# EAGLE design Schlangomat (EAGLE 7.2.0)

## Sheet 1 of 4
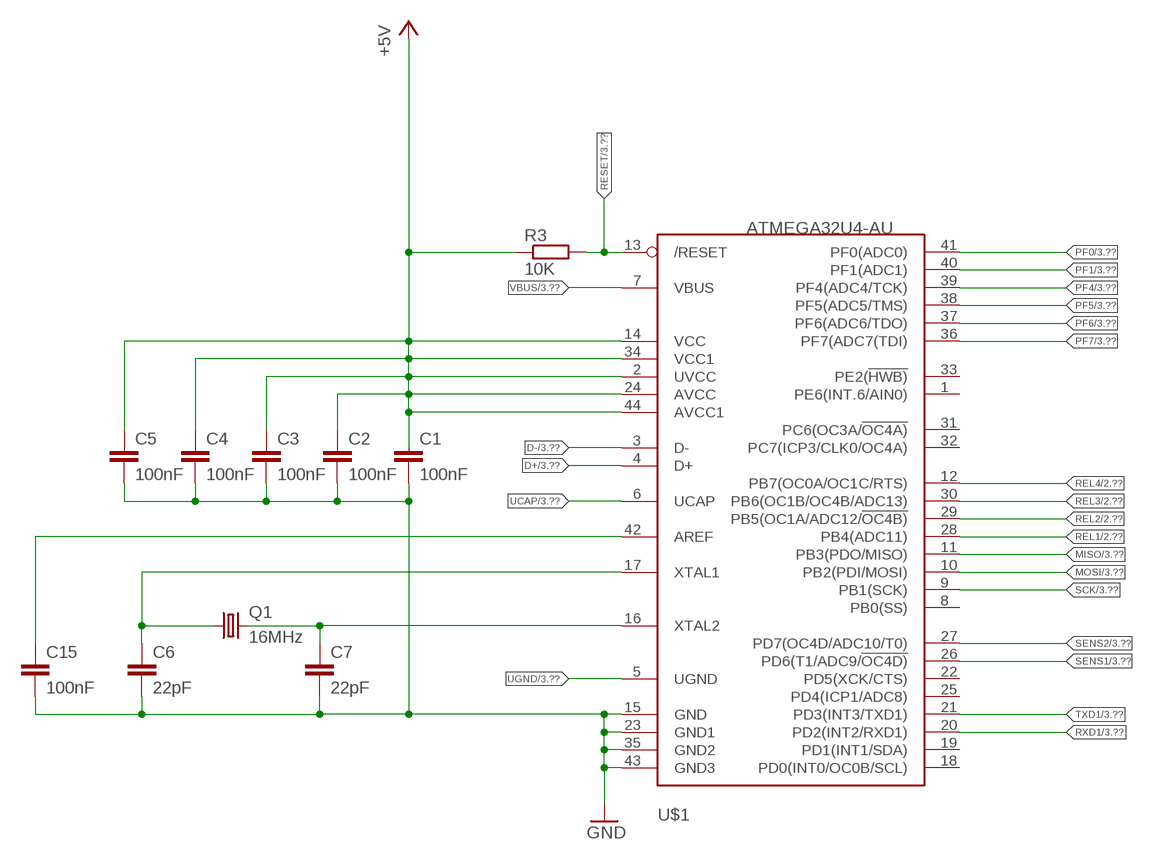
[diagram p0: schematic, sheet 1]

### Parts
C1  100nF  C-EUC0805  [C0805]
C2  100nF  C-EUC0805  [C0805]
C3  100nF  C-EUC0805  [C0805]
C4  100nF  C-EUC0805  [C0805]
C5  100nF  C-EUC0805  [C0805]
C6  22pF  C-EUC0805  [C0805]
C7  22pF  C-EUC0805  [C0805]
C15  100nF  C-EUC0805  [C0805]
Q1  16MHz  CRYSTALHC49S  [HC49/S]
R3  10K  R-EU_R0805  [R0805]
U$1  ATMEGA32U4-AU  [TQFP44]

### Nets
+5V [DC]: C1.1 C2.1 C3.1 C4.1 C5.1 R3.1 U$1.2(UVCC) U$1.14(VCC) U$1.24(AVCC) U$1.34(VCC1) U$1.44(AVCC1) ; also sheet 2,3,4
D+: U$1.4(D+) ; also sheet 3
D-: U$1.3(D-) ; also sheet 3
GND [DC]: C1.2 C2.2 C3.2 C4.2 C5.2 C6.2 C7.2 C15.2 U$1.15(GND) U$1.23(GND1) U$1.35(GND2) U$1.43(GND3) ; also sheet 2,3,4
MISO: U$1.11(PB3(PDO/MISO)) ; also sheet 3
MOSI: U$1.10(PB2(PDI/MOSI)) ; also sheet 3
N$3: C6.1 Q1.1 U$1.17(XTAL1)
N$4: C7.1 Q1.2 U$1.16(XTAL2)
N$11: C15.1 U$1.42(AREF)
PF0: U$1.41(PF0(ADC0)) ; also sheet 3
PF1: U$1.40(PF1(ADC1)) ; also sheet 3
PF4: U$1.39(PF4(ADC4/TCK)) ; also sheet 3
PF5: U$1.38(PF5(ADC5/TMS)) ; also sheet 3
PF6: U$1.37(PF6(ADC6/TDO)) ; also sheet 3
PF7: U$1.36(PF7(ADC7(TDI)) ; also sheet 3
REL1: U$1.28(PB4(ADC11)) ; also sheet 2
REL2: U$1.29(PB5(OC1A/ADC12/!OC4B)) ; also sheet 2
REL3: U$1.30(PB6(OC1B/OC4B/ADC13)) ; also sheet 2
REL4: U$1.12(PB7(OC0A/OC1C/RTS)) ; also sheet 2
RESET: R3.2 U$1.13(/RESET) ; also sheet 3
RXD1: U$1.20(PD2(INT2/RXD1)) ; also sheet 3
SCK: U$1.9(PB1(SCK)) ; also sheet 3
SENS1: U$1.26(PD6(T1/ADC9/!OC4D)) ; also sheet 3
SENS2: U$1.27(PD7(OC4D/ADC10/T0)) ; also sheet 3
TXD1: U$1.21(PD3(INT3/TXD1)) ; also sheet 3
UCAP: U$1.6(UCAP) ; also sheet 3
UGND: U$1.5(UGND) ; also sheet 3
VBUS: U$1.7(VBUS) ; also sheet 3
Unconnected: U$1.1(PE6(INT.6/AIN0)) U$1.8(PB0(SS)) U$1.18(PD0(INT0/OC0B/SCL)) U$1.19(PD1(INT1/SDA)) U$1.22(PD5(XCK/CTS)) U$1.25(PD4(ICP1/ADC8)) U$1.31(PC6(OC3A/!OC4A)) U$1.32(PC7(ICP3/CLK0/OC4A)) U$1.33(PE2(!HWB))

## Sheet 2 of 4: Relais
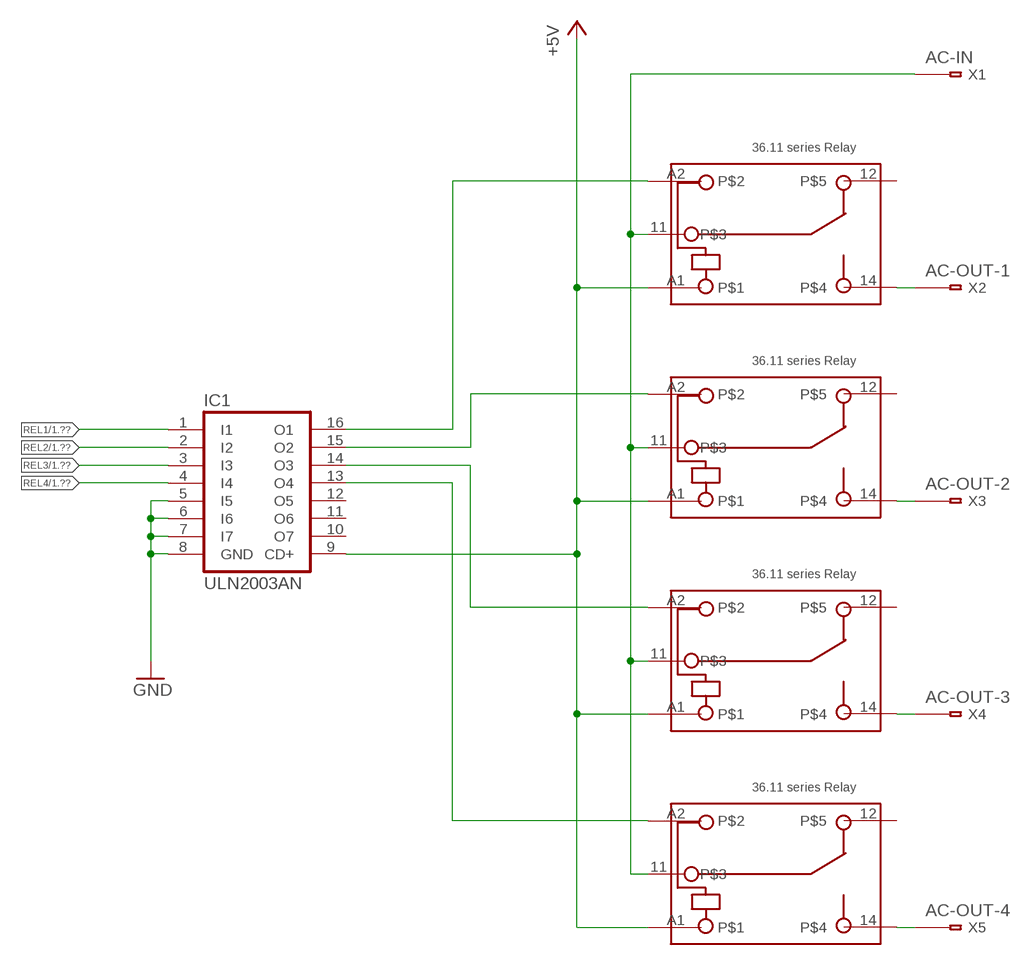
[diagram p1: schematic, sheet 2]

### Parts
IC1  ULN2003AN  [DIL16]
K1  36.11  [36.11]
K2  36.11  [36.11]
K3  36.11  [36.11]
K4  36.11  [36.11]
X1  AC-IN  236-501-7,62  [236-5XX]
X2  AC-OUT-1  236-501-7,62  [236-5XX]
X3  AC-OUT-2  236-501-7,62  [236-5XX]
X4  AC-OUT-3  236-501-7,62  [236-5XX]
X5  AC-OUT-4  236-501-7,62  [236-5XX]

### Nets
+5V [DC]: IC1.9(CD+) K1.A1 K2.A1 K3.A1 K4.A1 ; also sheet 1,3,4
AC_IN [AC]: K1.11 K2.11 K3.11 K4.11 X1.1@2(B1)
GND [DC]: IC1.5(I5) IC1.6(I6) IC1.7(I7) IC1.8(GND) ; also sheet 1,3,4
N$6: IC1.16(O1) K1.A2
N$7: IC1.15(O2) K2.A2
N$8: IC1.14(O3) K3.A2
N$9: IC1.13(O4) K4.A2
N$10: K1.14 X2.1@2(B1)
N$12: K2.14 X3.1@2(B1)
N$13: K3.14 X4.1@2(B1)
N$14: K4.14 X5.1@2(B1)
REL1: IC1.1(I1) ; also sheet 1
REL2: IC1.2(I2) ; also sheet 1
REL3: IC1.3(I3) ; also sheet 1
REL4: IC1.4(I4) ; also sheet 1
Unconnected: IC1.10(O7) IC1.11(O6) IC1.12(O5) K1.12 K2.12 K3.12 K4.12 X1.1@1(A1) X2.1@1(A1) X3.1@1(A1) X4.1@1(A1) X5.1@1(A1)

## Sheet 3 of 4: External
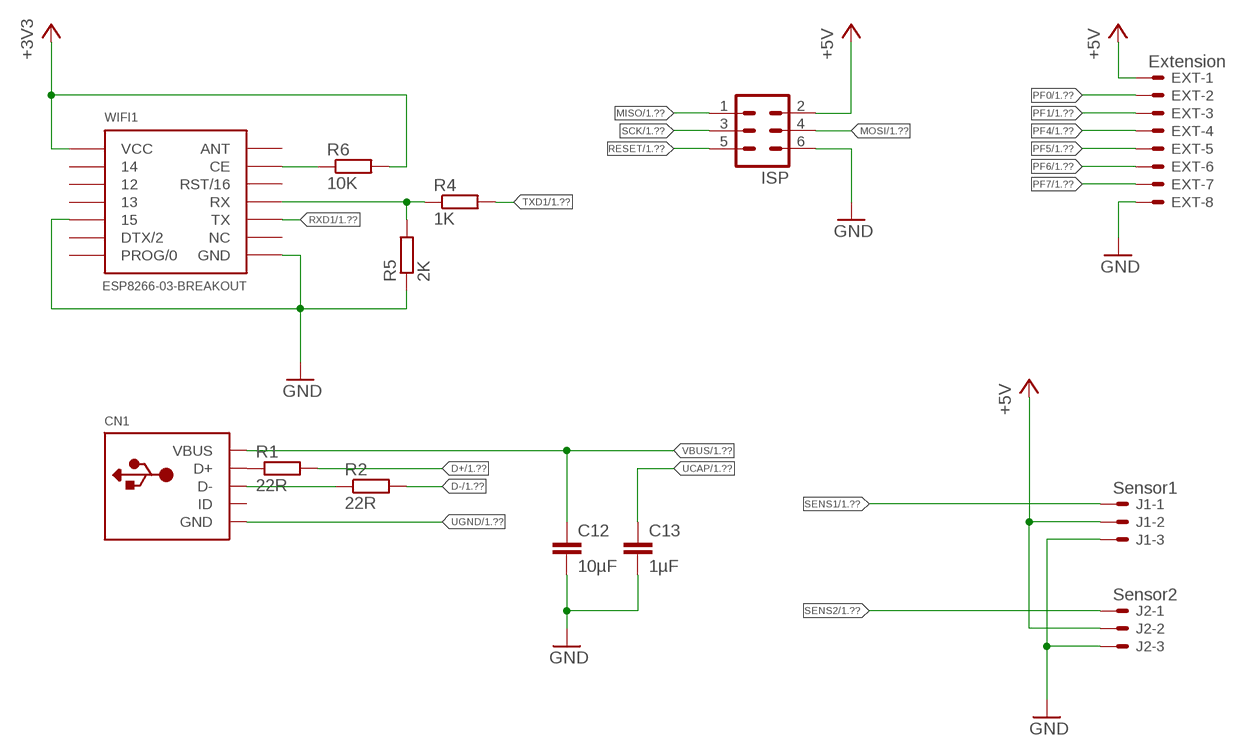
[diagram p2: schematic, sheet 3]

### Parts
C12  10µF  C-EUC0805  [C0805]
C13  1µF  C-EUC0805  [C0805]
CN1  USBMOLEX  [USB-MINIB-THM-MOLEX]
EXT  Extension  22-27-2081-08  [6410-08]
ISP  ML6  [ML6]
J1  Sensor1  22-27-2031-03  [6410-03]
J2  Sensor2  22-27-2031-03  [6410-03]
R1  22R  R-EU_R0805  [R0805]
R2  22R  R-EU_R0805  [R0805]
R4  1K  R-EU_R0805  [R0805]
R5  2K  R-EU_R0805  [R0805]
R6  10K  R-EU_R0805  [R0805]
WIFI1  ESP8266-03-BREAKOUT  [ESP-03-BREAKOUT]

### Nets
+3V3: R6.2 WIFI1.VCC ; also sheet 4
+5V [DC]: EXT.1 ISP.2 J1.2 J2.2 ; also sheet 1,2,4
D+: R1.2 ; also sheet 1
D-: R2.2 ; also sheet 1
GND [DC]: C12.2 C13.2 EXT.8 ISP.6 J1.3 J2.3 R5.1 WIFI1.15 WIFI1.GND ; also sheet 1,2,4
MISO: ISP.1 ; also sheet 1
MOSI: ISP.4 ; also sheet 1
N$1: CN1.D+ R1.1
N$2: CN1.D- R2.1
N$5: R6.1 WIFI1.CE
PF0: EXT.2 ; also sheet 1
PF1: EXT.3 ; also sheet 1
PF4: EXT.4 ; also sheet 1
PF5: EXT.5 ; also sheet 1
PF6: EXT.6 ; also sheet 1
PF7: EXT.7 ; also sheet 1
RESET: ISP.5 ; also sheet 1
RXD1: WIFI1.TX ; also sheet 1
SCK: ISP.3 ; also sheet 1
SENS1: J1.1 ; also sheet 1
SENS2: J2.1 ; also sheet 1
TXD1: R4.1 R4.2 R5.2 WIFI1.RX ; also sheet 1
UCAP: C13.1 ; also sheet 1
UGND: CN1.GND ; also sheet 1
VBUS: C12.1 CN1.VBUS ; also sheet 1
Unconnected: CN1.ID WIFI1.12 WIFI1.13 WIFI1.14 WIFI1.ANT WIFI1.DTX/2 WIFI1.NC WIFI1.PROG/0 WIFI1.RST/16

## Sheet 4 of 4: Power
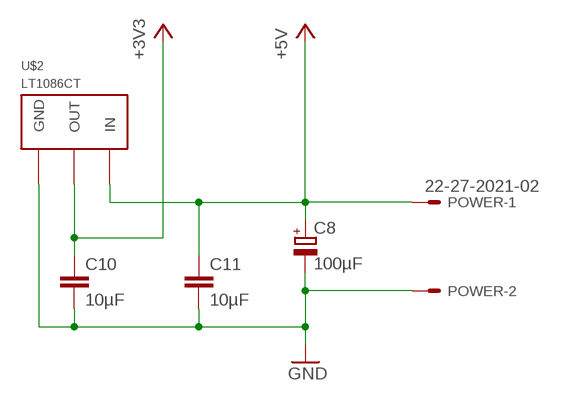
[diagram p3: schematic, sheet 4]

### Parts
C8  100µF  CPOL-EUUD-5X5,8  [UD-5X5,8_NICHICON]
C10  10µF  C-EUC0805  [C0805]
C11  10µF  C-EUC0805  [C0805]
POWER  22-27-2021-02  [6410-02]
U$2  LT1086CT  [TO220V]

### Nets
+3V3: C10.1 U$2.2(OUT) ; also sheet 3
+5V [DC]: C8.+ C11.1 POWER.1 U$2.3(IN) ; also sheet 1,2,3
GND [DC]: C8.- C10.2 C11.2 POWER.2 U$2.1(GND) ; also sheet 1,2,3

## Library data of the parts
C1-C7 C10-C13 C15 = rcl:C-EU: CAPACITOR, European symbol
C8 = rcl:CPOL-EU: POLARIZED CAPACITOR, European symbol
CN1 = adafruit:USB: USB Connectors USBMINIB - Surface Mount Female Mini-B USB Connector 4UConnector: 06564 By microbuilder.eu Thru-hole RA Female Mini-B USB Connector 4UConnector: 18732 By ladyada.net
EXT = con-molex:22-?-08: CONNECTOR wire to board 2.54 mm (.1 inch) pitch header; OC_FARNELL: unknown; OC_NEWARK: unknown
IC1 = uln-udn:ULN2003A: DRIVER ARRAY
ISP = con-harting-ml:ML6: HARTING; OC_FARNELL: unknown; OC_NEWARK: unknown
J1 J2 = con-molex:22-?-03: CONNECTOR wire to board 2.54 mm (.1 inch) pitch header; OC_FARNELL: unknown; OC_NEWARK: unknown
K1-K4 = relay_finder_36_11:36.11: Printed circuit mount miniature 10 A relay one pole changeover contacts Conform RoHS
POWER = con-molex:22-?-02: CONNECTOR wire to board 2.54 mm (.1 inch) pitch header; OC_FARNELL: unknown; OC_NEWARK: unknown
Q1 = crystal:CRYSTAL: CRYSTAL; OC_FARNELL: 1667008; OC_NEWARK: unknown
R1-R6 = rcl:R-EU_: RESISTOR, European symbol
U$1 = adafruit:ATMEGA32U4: http://www.ladyada.net/library/eagle
U$2 = Zap-Powerconverters:LT1086CT
WIFI1 = ZAP-Wireless:ESP8266-03-BREAKOUT
X1-X5 = con-wago:236: Anreihbare Einzelklemme 2,5 mm² 16A Rastermaß 5/5,08 | 7,5/7,62 | 10/10,16

## Net classes
1 AC: width 2 mm, clearance 2 mm
2 DC: width 0.508 mm

## Board
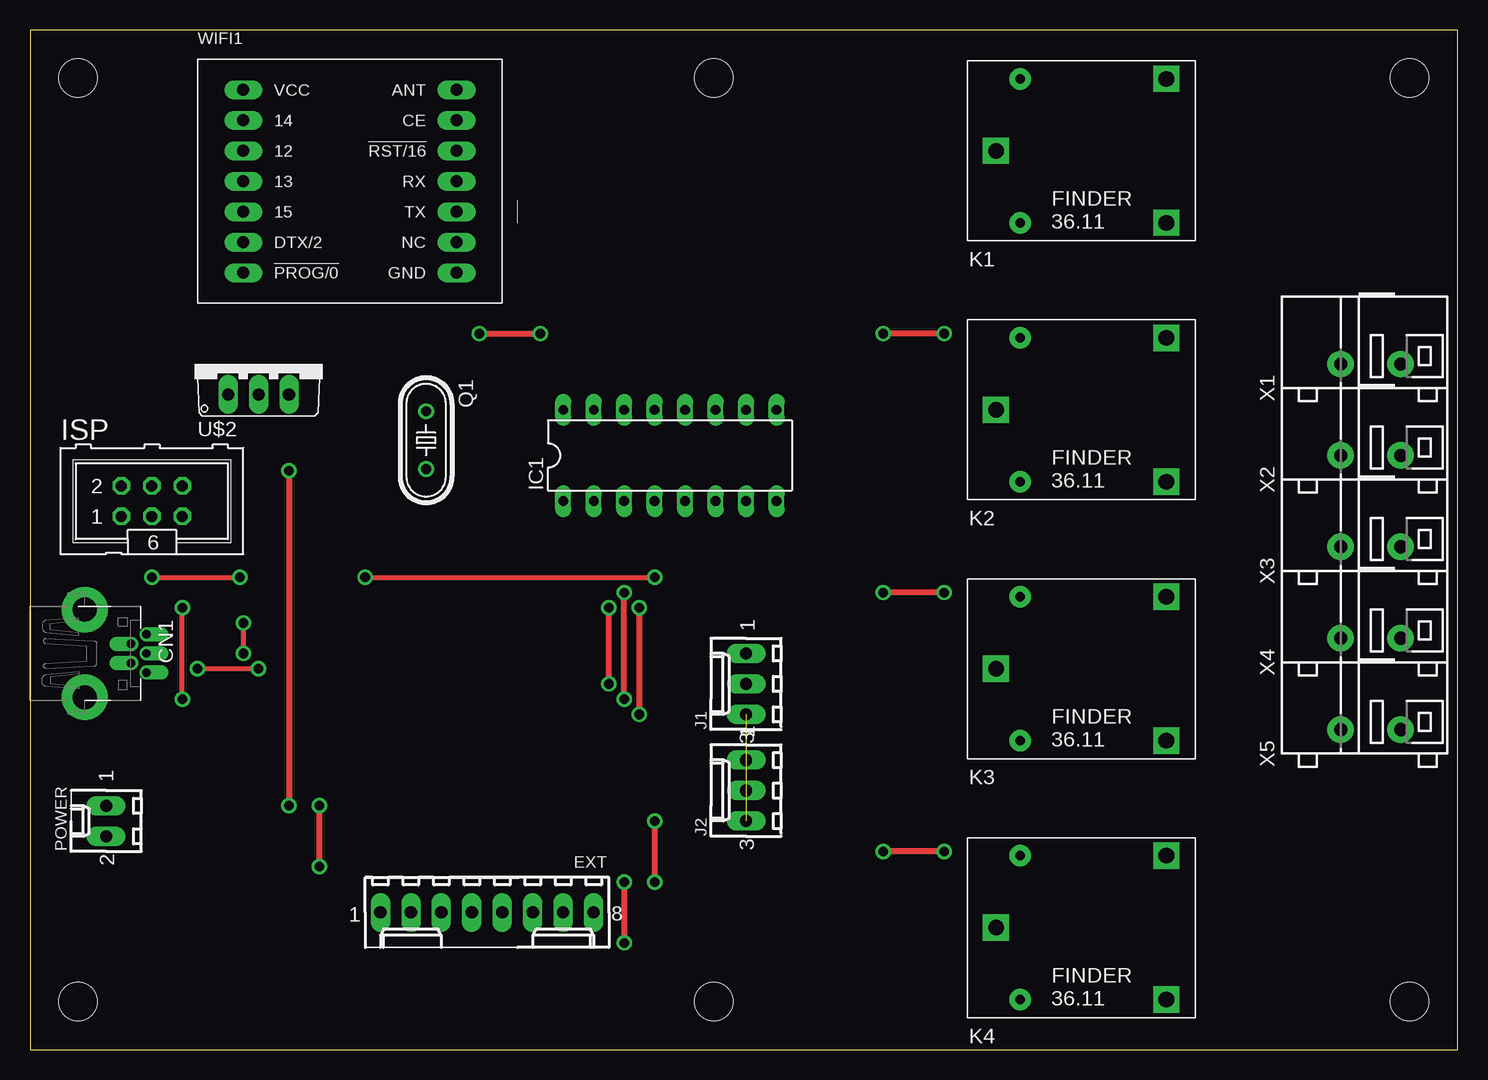
[diagram p4: board, top side]
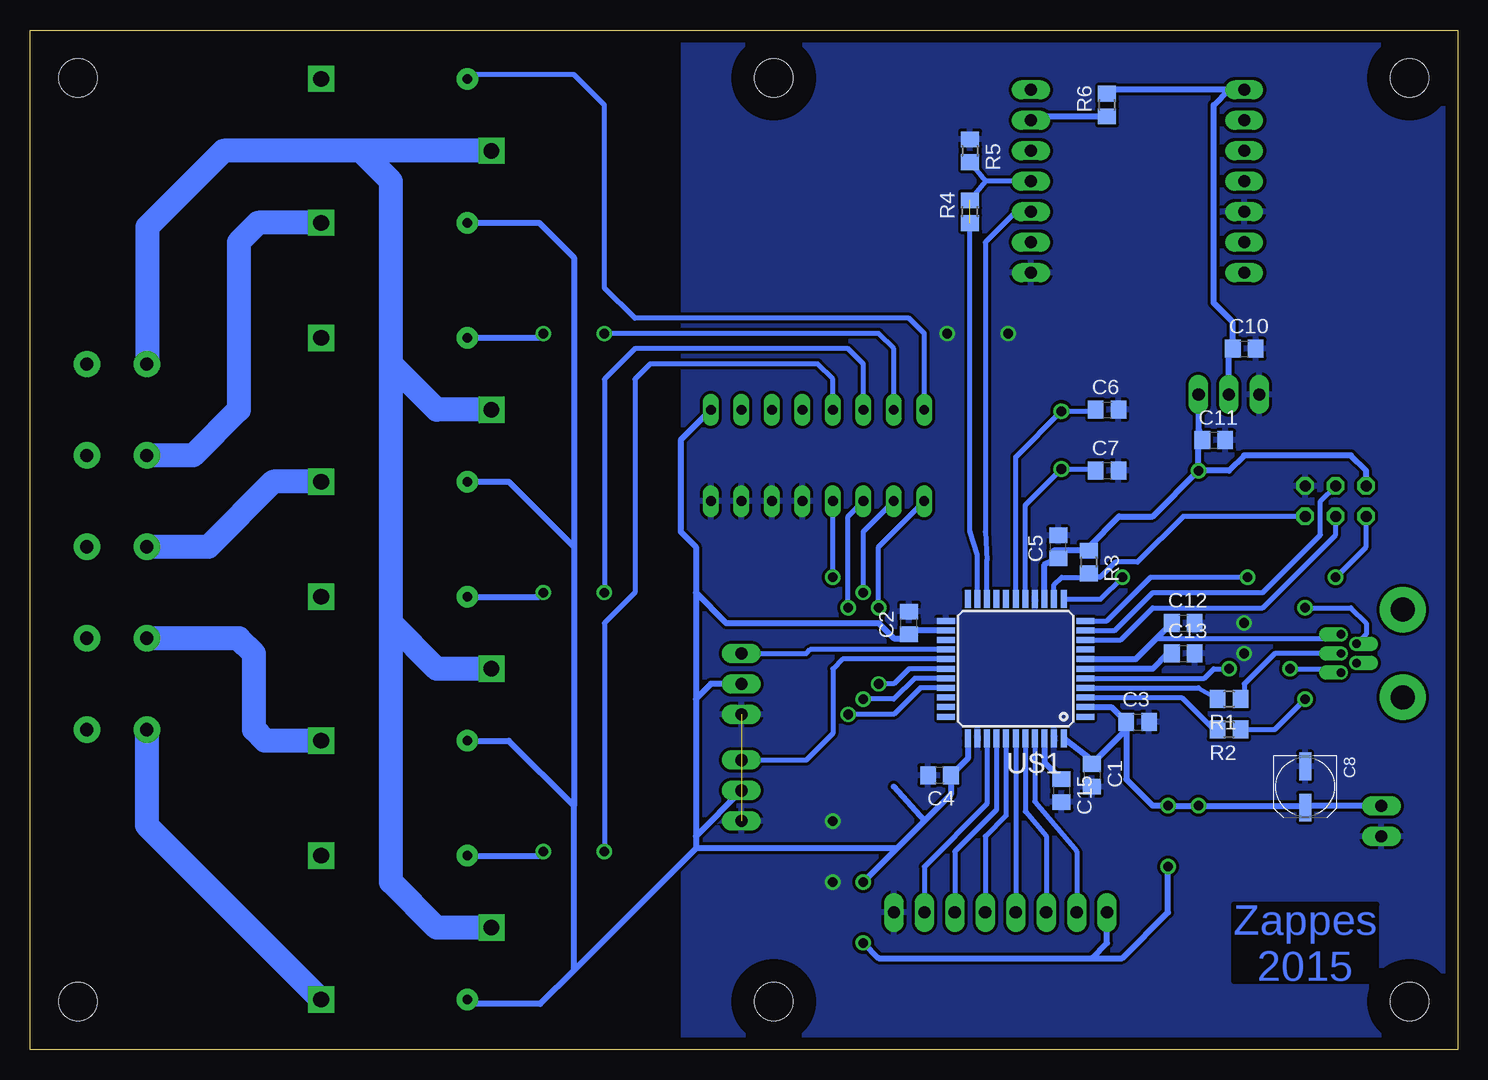
[diagram p5: board, bottom side, seen from below]

Size 119 x 85 mm. Coordinates in mm from the lower left corner, seen from the top.
Outline: 0,0 119,0 119,85 0,85 0,0
Copper layers (1*16): Top 0.035mm / dielectric 1.5mm / Bottom 0.035mm
Design rules "default *": minimum track width 10mil, minimum drill 24mil, track to track 10mil, track to pad 10mil, pad to pad 10mil, via to via 10mil, smd to smd 10mil, copper to edge 40mil, drill to drill 8mil, minimum pad ring 10mil, minimum via ring 8mil, stop-mask expansion 4mil, vias tented up to drill 0mil, thermal gap 10mil
Holes 3.2 mm at 115,81 115,4 4,4 4,81 57,4 57,81
bRestrict: area 1.5,78.5 to 6.5,83.5; area 54.5,78.5 to 59.5,83.5; area 54.5,1.5 to 59.5,6.5; area 1.5,1.5 to 6.5,6.5

### Footprints (pad centres in the part's own frame; a part is rotated, then mirrored left to right if it is on the bottom)
C0805 = smd 1.3 x 1.5: 1 -0.95,0; 2 0.95,0
UD-5X5,8_NICHICON = smd 2.3 x 1: + 1.725,0; - -1.7,0
USB-MINIB-THM-MOLEX = drill 0.7 offset: D+ 0,9.72; D- -0.8,8.42; GND 1.6,9.72; ID 0.8,8.42; VBUS -1.6,9.72 | drill 2 pad 3.81: GND1 -3.65,4.57; GND4 3.65,4.57
6410-08 = drill 1.016 long: 1 8.89,0; 2 6.35,0; 3 3.81,0; 4 1.27,0; 5 -1.27,0; 6 -3.81,0; 7 -6.35,0; 8 -8.89,0
DIL16 = drill 0.813 long: 1 -8.89,-3.81; 2 -6.35,-3.81; 3 -3.81,-3.81; 4 -1.27,-3.81; 5 1.27,-3.81; 6 3.81,-3.81; 7 6.35,-3.81; 8 8.89,-3.81; 9 8.89,3.81; 10 6.35,3.81; 11 3.81,3.81; 12 1.27,3.81; 13 -1.27,3.81; 14 -3.81,3.81; 15 -6.35,3.81; 16 -8.89,3.81
ML6 = drill 0.914 octagon: 1 -2.54,-1.27; 2 -2.54,1.27; 3 0,-1.27; 4 0,1.27; 5 2.54,-1.27; 6 2.54,1.27
6410-03 = drill 1.016 long: 1 2.54,0; 2 0,0; 3 -2.54,0
36.11 = drill 1.3 pad 2.184 square: 11 -7.1,0; 12 7.1,6; 14 7.1,-6 | drill 0.8 pad 1.778: A1 -5.1,-6; A2 -5.1,6
6410-02 = drill 1.016 long: 1 1.27,0; 2 -1.27,0
HC49/S = drill 0.813: 1 -2.413,0; 2 2.413,0
R0805 = smd 1.3 x 1.5: 1 -0.95,0; 2 0.95,0
TQFP44 = smd 1.5 x 0.5: 1 -5.8,4; 2 -5.8,3.2; 3 -5.8,2.4; 4 -5.8,1.6; 5 -5.8,0.8; 6 -5.8,0; 7 -5.8,-0.8; 8 -5.8,-1.6; 9 -5.8,-2.4; 10 -5.8,-3.2; 11 -5.8,-4; 23 5.8,-4; 24 5.8,-3.2; 25 5.8,-2.4; 26 5.8,-1.6; 27 5.8,-0.8; 28 5.8,0; 29 5.8,0.8; 30 5.8,1.6; 31 5.8,2.4; 32 5.8,3.2; 33 5.8,4 | smd 0.5 x 1.5: 12 -4,-5.8; 13 -3.2,-5.8; 14 -2.4,-5.8; 15 -1.6,-5.8; 16 -0.8,-5.8; 17 0,-5.8; 18 0.8,-5.8; 19 1.6,-5.8; 20 2.4,-5.8; 21 3.2,-5.8; 22 4,-5.8; 34 4,5.8; 35 3.2,5.8; 36 2.4,5.8; 37 1.6,5.8; 38 0.8,5.8; 39 0,5.8; 40 -0.8,5.8; 41 -1.6,5.8; 42 -2.4,5.8; 43 -3.2,5.8; 44 -4,5.8
TO220V = drill 1.016 long: 1 -2.54,-2.54; 2 0,-2.54; 3 2.54,-2.54
ESP-03-BREAKOUT = drill 1 long: 12 -8.89,2.54; 13 -8.89,0; 14 -8.89,5.08; 15 -8.89,-2.54; ANT 8.89,7.62; CE 8.89,5.08; DTX/2 -8.89,-5.08; GND 8.89,-7.62; NC 8.89,-5.08; PROG/0 -8.89,-7.62; RST/16 8.89,2.54; RX 8.89,0; TX 8.89,-2.54; VCC -8.89,7.62
236-5XX = drill 1.1 pad 2.2: 1@1 0,-2.5; 1@2 0,2.5

### Placement (x,y rotation side)
C1  30.48,22.86 270 bottom
C2  45.72,35.56 90 bottom
C3  26.67,27.3 0 bottom
C4  43.18,22.86 180 bottom
C5  33.29,41.91 90 bottom
C6  29.21,53.34 0 bottom
C7  29.21,48.26 0 bottom
C8  12.7,21.91 270 bottom
C10  17.78,58.42 0 bottom
C11  20.32,50.8 0 bottom
C12  22.86,35.56 0 bottom
C13  22.86,33.02 0 bottom
C15  33.02,21.59 270 bottom
CN1  0,33.02 270 top
EXT  38.1,11.43 180 top
IC1  53.34,49.53 0 top
ISP  10.16,45.72 0 top
J1  59.69,30.48 90 top
J2  59.69,21.59 90 top
K1  87.63,74.93 0 top
K2  87.63,53.34 0 top
K3  87.63,31.75 0 top
K4  87.63,10.16 0 top
POWER  6.35,19.05 90 top
Q1  33.02,50.8 270 top
R1  19.05,29.21 180 bottom
R2  19.05,26.67 180 bottom
R3  30.75,40.64 270 bottom
R4  40.64,69.85 90 bottom
R5  40.64,74.93 270 bottom
R6  29.21,78.74 90 bottom
U$1  36.83,31.75 180 bottom
U$2  19.05,57.15 0 top
WIFI1  26.67,72.39 0 top
X1  111.76,57.15 90 top
X2  111.76,49.53 90 top
X3  111.76,41.91 90 top
X4  111.76,34.29 90 top
X5  111.76,26.67 90 top

### Tracks (layer width: path | path; a pad name or v marks a point on that pad's centre or on a via)
+3V3
  Bottom 0.508: U$2.2 19.05,58.1 C10.1 18.73,60.64 20.32,62.23 20.32,78.74 19.05,80.01 WIFI1.VCC 28.89,80.01 R6.2
+5V  (via drill 0.8)
  Top 0.508: v21.59,48.26 v21.59,20.32 | v24.13,15.24 v24.13,20.32 | v49.53,13.97 v49.53,8.89
  Bottom 0.406: 63.5,16.78 63.5,17.78
  Bottom 0.508: 27.62,26.67 C1.1 30.48,24.13 U$1.44 | U$1.14 34.43,40.42 C5.1 33.66,41.59 R3.1 30.75,41.91 28.21,44.45 25.4,44.45 v21.59,48.26 | U$1.34 40.83,24.26 C4.1 42.23,21.27 44.45,19.05 | U$1.24 45.43,34.95 C2.1 46.04,34.29 46.99,34.29 48.26,35.56 60.96,35.56 63.5,38.1 | U$2.3 21.59,51.75 C11.1 21.59,50.48 v21.59,48.26 | IC1.9 64.77,50.8 64.77,43.18 63.5,41.91 63.5,38.1 | K1.A1 76.55,68.93 73.66,66.04 73.66,41.91 | 73.66,41.91 73.66,20.32 | 73.66,6.62 76.47,3.81 82.18,3.81 K4.A1 | K3.A1 79.09,25.75 73.66,20.32 | K2.A1 79.09,47.34 73.66,41.91 | 63.5,38.1 63.5,29.21 | 63.5,29.21 63.5,16.78 | 73.66,6.62 73.66,20.32 | 27.62,26.67 C3.1 28.86,28.55 U$1.2 | 44.45,19.05 46.99,21.91 | 44.45,19.05 46.72,16.78 | 46.72,16.78 63.5,16.78 | J1.2 62.23,30.48 63.5,29.21 | POWER.1 12.56,20.32 C8.+ 12.84,20.32 v21.59,20.32 v24.13,20.32 25.4,20.32 27.62,22.54 27.62,26.67 | 73.66,6.62 63.5,16.78 | ISP.2 7.62,48.26 8.89,49.53 17.78,49.53 19.05,48.26 v21.59,48.26 | 46.72,16.78 v49.53,13.97 | 30.48,7.62 48.26,7.62 v49.53,8.89 | 30.48,7.62 29.21,8.89 EXT.1 | 30.48,7.62 27.94,7.62 24.13,11.43 v24.13,15.24 | 63.5,17.78 J2.2
AC_IN
  Bottom 2: K1.11 91.44,74.93 | 91.44,74.93 102.87,74.93 109.22,68.58 109.22,57.19 X1.1@2 | K2.11 85.09,53.34 88.9,57.15 | 88.9,57.15 88.9,72.39 91.44,74.93 | K3.11 85.09,31.75 88.9,35.56 | 88.9,35.56 88.9,57.15 | K4.11 85.09,10.16 88.9,13.97 88.9,35.56
D+
  Bottom 0.406: U$1.4 21.6,30.15 R1.2
D-
  Bottom 0.406: U$1.3 23,29.35 20.32,26.67 R2.2
GND  (via drill 0.8)  (1 unrouted)
  Top 0.406: v17.78,35.56 v17.78,33.02
  Top 0.508: v52.07,19.05 v52.07,13.97 | v37.47,59.69 v42.55,59.69
  pour Bottom: 0,85 0,0 64.46,0 64.46,85
MISO  (via drill 0.8)
  Top 0.406: v10.16,39.37 v17.51,39.37
  Bottom 0.406: U$1.11 29.21,35.75 25.59,39.37 v17.51,39.37 | v10.16,39.37 7.62,41.91 ISP.1
MOSI
  Bottom 0.406: U$1.10 28.55,34.95 25.4,38.1 16.24,38.1 11.43,42.91 11.43,45.72 ISP.4
N$1
  Bottom 0.406: CN1.D+ 15.24,33.02 17.78,30.48 17.78,29.21 R1.1
N$2  (via drill 0.8)
  Top 0.406: v12.7,29.21 v12.7,36.83
  Bottom 0.406: R2.1 15.24,26.67 v12.7,29.21 | v12.7,36.83 8.89,36.83 7.62,35.56 7.62,34.62 CN1.D-
N$3
  Bottom 0.406: C6.1 30.29,53.21 Q1.1 36.83,49.4 U$1.17
N$4
  Bottom 0.406: C7.1 30.29,48.39 Q1.2 36.03,45.38 U$1.16
N$5
  Bottom 0.508: R6.1 35.24,77.79 WIFI1.CE
N$6
  Bottom 0.406: IC1.16 44.45,59.69 45.72,60.96 68.58,60.96 71.12,63.5 71.12,78.74 73.66,81.28 82.18,81.28 K1.A2
N$7  (via drill 0.8 pad 0.8)
  Top 0.508: v76.2,59.69 v71.12,59.69
  Bottom 0.406: IC1.15 46.99,58.42 48.26,59.69 v71.12,59.69
  Bottom 0.508: K2.A2 76.55,59.34 v76.2,59.69
N$8  (via drill 0.8 pad 0.8)
  Top 0.508: v76.2,38.1 v71.12,38.1
  Bottom 0.406: IC1.14 49.53,57.15 50.8,58.42 68.58,58.42 71.12,55.88 v71.12,38.1
  Bottom 0.508: K3.A2 76.55,37.75 v76.2,38.1
N$9  (via drill 0.8 pad 0.8)
  Top 0.508: v76.2,16.51 v71.12,16.51
  Bottom 0.406: IC1.13 52.07,55.88 53.34,57.15 67.31,57.15 68.58,55.88 68.58,38.1 71.12,35.56 v71.12,16.51
  Bottom 0.508: K4.A2 76.55,16.16 v76.2,16.51
N$10
  Bottom 2: K1.14 99.98,68.93 101.6,67.31 101.6,53.34 105.41,49.53 X2.1@2
N$11
  Bottom 0.508: U$1.42 34.43,23.95 C15.1
N$12
  Bottom 2: K2.14 98.71,47.34 104.14,41.91 X3.1@2
N$13
  Bottom 2: K3.14 99.41,25.75 100.33,26.67 100.33,33.02 101.6,34.29 X4.1@2
N$14
  Bottom 2: X5.1@2 109.26,18.69 K4.14
PF0
  Bottom 0.406: U$1.41 35.23,20.65 31.75,16.51 EXT.2
PF1
  Bottom 0.406: U$1.40 36.03,19.85 34.29,17.78 EXT.3
PF4
  Bottom 0.406: U$1.39 EXT.4
PF5
  Bottom 0.406: U$1.38 37.63,19.52 39.37,17.78 EXT.5
PF6
  Bottom 0.406: U$1.37 38.43,19.99 41.91,16.51 EXT.6
PF7
  Bottom 0.406: U$1.36 39.23,20.46 44.45,15.24 EXT.7
REL1  (via drill 0.8 pad 0.8)
  Top 0.508: v48.26,30.48 v48.26,36.83
  Bottom 0.406: U$1.28 45.72,31.75 46.99,30.48 v48.26,30.48 | v48.26,36.83 48.26,41.91 IC1.1
REL2  (via drill 0.8 pad 0.8)
  Top 0.508: v49.53,29.21 v49.53,38.1
  Bottom 0.406: U$1.29 45.25,30.95 46.99,29.21 v49.53,29.21 | v49.53,38.1 49.53,43.18 IC1.2
REL3  (via drill 0.8 pad 0.8)
  Top 0.508: v50.8,27.94 v50.8,36.83
  Bottom 0.406: U$1.30 44.78,30.15 46.99,27.94 v50.8,27.94 | v50.8,36.83 50.8,44.45 IC1.3
REL4  (via drill 0.8, 0.8 pad 0.8)
  Top 0.406: v27.94,39.37 v52.07,39.37
  Bottom 0.406: U$1.12 29.76,37.55 v27.94,39.37 | v52.07,39.37 IC1.4
RESET
  Bottom 0.406: ISP.5 22.86,44.45 26.67,40.64 28.53,40.64 29.8,39.37 R3.2 31.07,39.37 | 30.75,39.37 31.07,39.37 | U$1.13 33.63,38.76 33.02,39.37 31.07,39.37
RXD1
  Bottom 0.406: WIFI1.TX 36.83,69.85 39.37,67.31 39.37,43.18 39.23,40.78 U$1.20
SCK
  Bottom 0.406: U$1.9 28.08,34.15 25.4,36.83 16.24,36.83 10.16,42.91 ISP.3
SENS1
  Bottom 0.406: J1.1 54.29,33.02 53.96,33.35 U$1.26
SENS2
  Bottom 0.406: J2.1 54.29,24.13 52.07,26.35 52.07,31.75 51.27,32.55 U$1.27
TXD1  (1 unrouted)
  Bottom 0.406: WIFI1.RX 39.37,72.39 | 39.37,72.39 R4.2 | R5.2 39.37,72.39 | U$1.21 40.03,41.25 40.64,43.18 R4.1
UCAP
  Bottom 0.508: C13.1 24.13,33.02 25.4,31.75 U$1.6
UGND  (via drill 0.8)
  Top 0.406: v19.05,31.75 v13.97,31.75
  Bottom 0.406: U$1.5 21.12,30.95 20.32,31.75 v19.05,31.75 | v13.97,31.75 10.05,31.75 CN1.GND
VBUS
  Bottom 0.406: 25.09,34.28 10.06,34.28 CN1.VBUS
  Bottom 0.508: U$1.7 26.82,32.55 25.09,34.28 C12.1

### Text on the board
Bottom: Zappes / 2015